# EAGLE design elektrosluch (EAGLE 7.3.0)
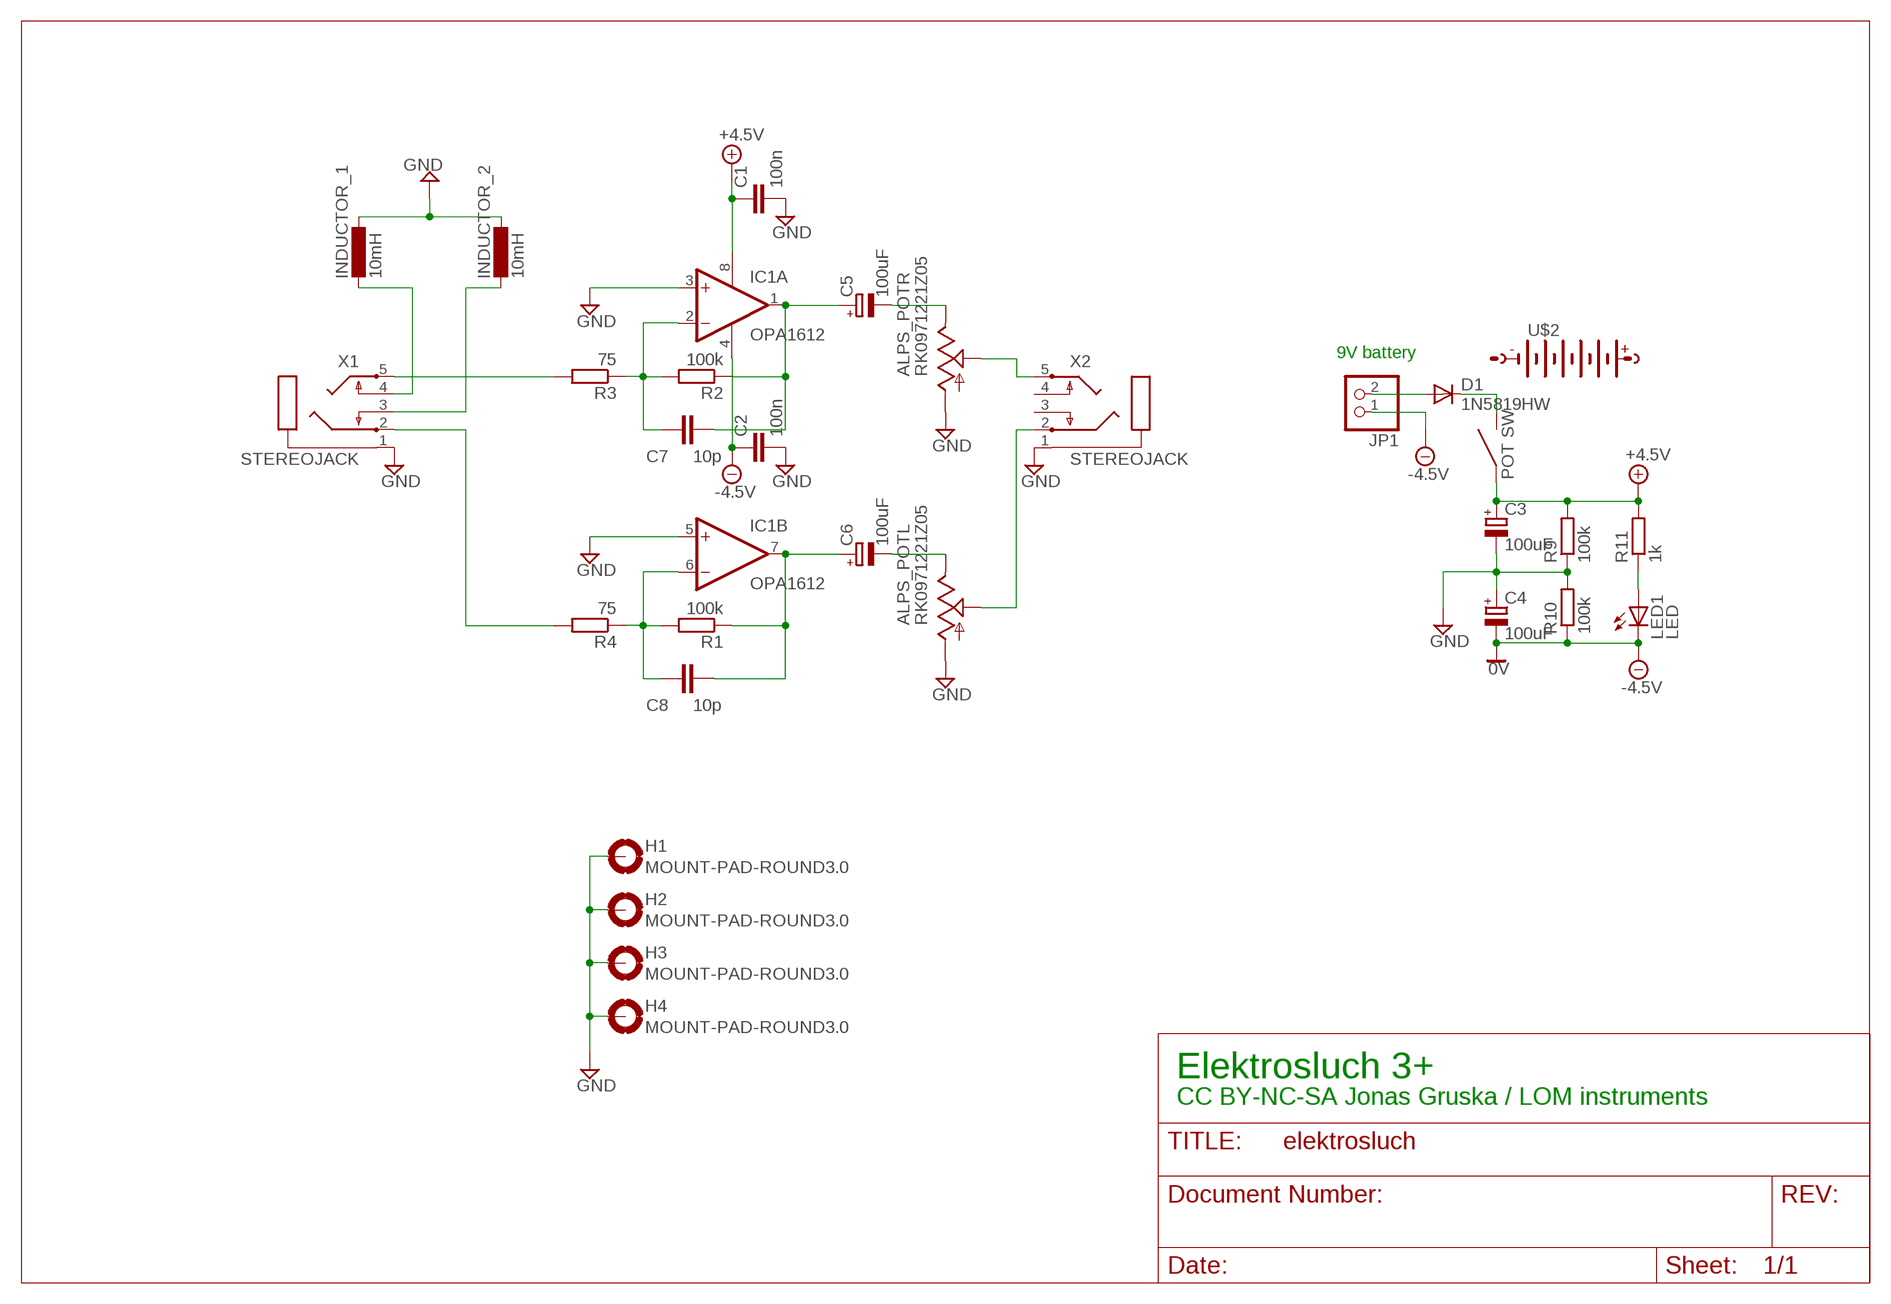
[diagram p0: schematic, sheet 1]

## Parts
ALPS_POT  RK0971221Z05  ALPS_RK0971221Z0N  [ALPS_RK0971221Z0X]
C1  100n  C-EUC0603  [C0603]
C2  100n  C-EUC0603  [C0603]
C3  100uF  CPOL-EUUD-6,3X8,8  [UD-6,3X5,8_NICHICON]
C4  100uF  CPOL-EUUD-6,3X8,8  [UD-6,3X5,8_NICHICON]
C5  100uF  CPOL-EUUD-6,3X8,8  [UD-6,3X5,8_NICHICON]
C6  100uF  CPOL-EUUD-6,3X8,8  [UD-6,3X5,8_NICHICON]
C7  10p  C-EUC0603  [C0603]
C8  10p  C-EUC0603  [C0603]
D1  1N5819HW  DIODE-SOD123  [SOD123]
H1  MOUNT-PAD-ROUND3.0  [3,0-PAD]
H2  MOUNT-PAD-ROUND3.0  [3,0-PAD]
H3  MOUNT-PAD-ROUND3.0  [3,0-PAD]
H4  MOUNT-PAD-ROUND3.0  [3,0-PAD]
IC1  OPA1612  OPA2134UA  [SO08]
INDUCTOR_1  10mH  COIL  [COIL]
INDUCTOR_2  10mH  COIL  [COIL]
JP1  PINHD-1X2  [1X02]
LED1  LED  [LED3MM]
R1  100k  R-EU_R0805  [R0805]
R2  100k  R-EU_R0805  [R0805]
R3  75  R-EU_R0805  [R0805]
R4  75  R-EU_R0805  [R0805]
R9  100k  R-EU_R0805  [R0805]
R10  100k  R-EU_R0805  [R0805]
R11  1k  R-EU_R0805  [R0805]
U$2  BATT  [BATT]
X1  STEREOJACK  [STX3100]
X2  STEREOJACK  [STX3100]

## Nets
+5V: ALPS_POT.S1 C1.1 C3.+ IC1.8(A:V+) R9.2 R11.2 ; supply symbol labelled +4.5V
-5V: C2.1 C4.- IC1.4(A:V-) JP1.1 LED1.K(C) R10.1 ; supply symbol labelled -4.5V, 0V
GND: ALPS_POT.G1 ALPS_POT.G2 C1.2 C2.2 C3.- C4.+ H1.B3,0(MOUNT) H2.B3,0(MOUNT) H3.B3,0(MOUNT) H4.B3,0(MOUNT) IC1.3(A:+IN) IC1.5(B:+IN) INDUCTOR_1.P$1 INDUCTOR_2.P$1 R9.1 R10.2 X1.1 X2.1
N$1: C7.1 IC1.2(A:-IN) R2.2 R3.1
N$2: C5.+ C7.2 IC1.1(A:OUT) R2.1
N$3: ALPS_POT.I1 C6.-
N$4: C8.1 IC1.6(B:-IN) R1.2 R4.1
N$5: C6.+ C8.2 IC1.7(B:OUT) R1.1
N$6: ALPS_POT.I2 C5.-
N$7: ALPS_POT.O2 X2.5
N$8: R3.2 X1.5
N$9: ALPS_POT.O1 X2.2
N$10: R4.2 X1.2
N$11: D1.A JP1.2
N$12: INDUCTOR_1.P$2 X1.4
N$13: INDUCTOR_2.P$2 X1.3
N$14: LED1.A R11.1
N$16: ALPS_POT.S2 D1.C
Unconnected: X2.3 X2.4

## Notes on the sheet
- 9V battery
- Elektrosluch 3+
- CC BY-NC-SA Jonas Gruska / LOM instruments

## Library data of the parts
ALPS_POT = audio-pots:ALPS_RK0971221Z0*: ALPS RK0971221Z Dual-gang 9mm potentiometer for volume control, with SPST switch -05 model: 10K with "volume" taper -0N model: 50K with traditional audio taper
C1 C2 C7 C8 = rcl:C-EU: CAPACITOR, European symbol
C3-C6 = rcl:CPOL-EU: POLARIZED CAPACITOR, European symbol
D1 = diode:DIODE-: DIODE
H1-H4 = holes:MOUNT-PAD-ROUND: MOUNTING PAD, round
IC1 = linear:OPA2*: Dual Operational Amplifier Low Power, Single-Supply, Rail-To-Rail Operational Amplifier Source: http://focus.ti.com/lit/ds/symlink/opa2345.pdf http://focus.ti.com .. opa241.pdf http://focus.ti.com/lit/ds/symlink/opa2134.pdf
INDUCTOR_1 INDUCTOR_2 = mojakniznica:COIL
JP1 = pinhead:PINHD-1X2: PIN HEADER
LED1 = mojakniznica:LED
R1-R4 R9-R11 = rcl:R-EU_: RESISTOR, European symbol
U$2 = mojakniznica:BATT
X1 X2 = adafruit:STEREOJACK: MIC/HEADPHONE JACK Stereo jack with two switches. Kycon STX3100, CUI SJ1-3555NG and/or 4UCon 05544

## Board
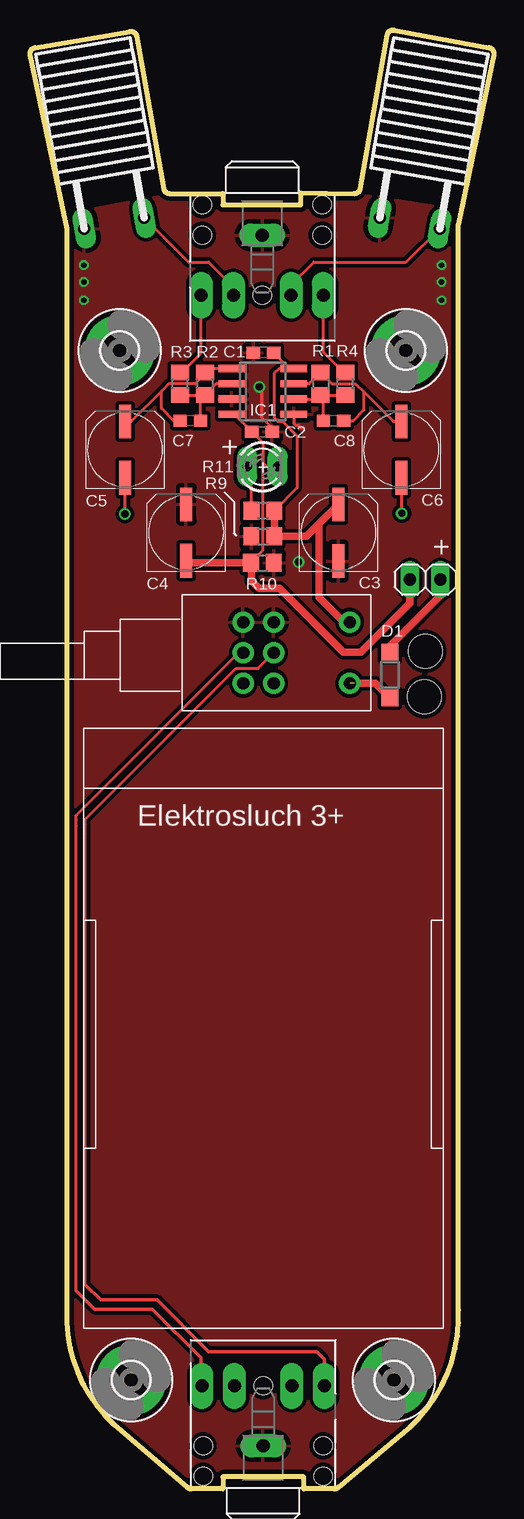
[diagram p1: board, top side]
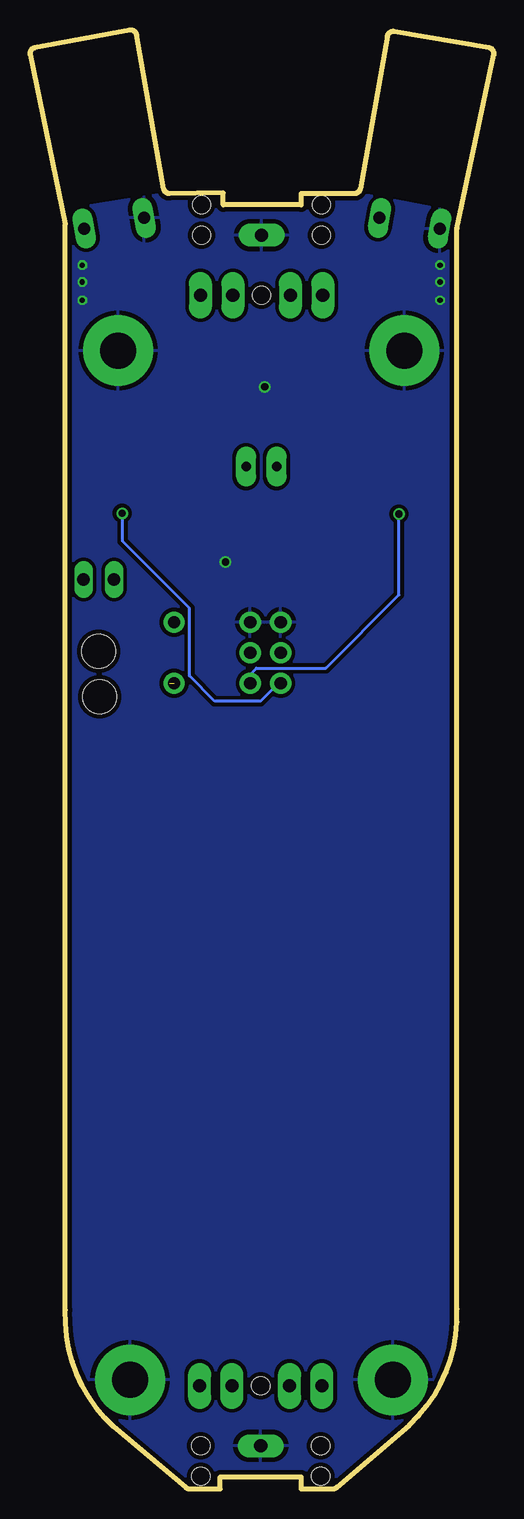
[diagram p2: board, bottom side, seen from below]

Size 38.7 x 121.58 mm. Coordinates in mm from the lower left corner, seen from the top.
Outline: 25.72,0.15 31.72,5.19 arc50 35.74,14.91 35.74,105.41 38.69,119.52 arc90 38.29,120.11 30.39,121.57 arc90 29.8,121.17 27.56,108.36 arc-80 27.06,107.95 22.59,108 22.59,107 16.09,107 16.09,107.95 11.65,107.95 arc-79 11.15,108.36 8.9,121.05 arc89 8.32,121.45 0.42,120.1 arc90 0.01,119.52 3.09,105.03 3.09,14.98 arc50 7.05,5.32 13.11,0.15 arc45 13.47,0 16.09,0 16.09,1 22.84,1 22.84,0 25.36,0 arc45 25.72,0.15
Copper layers (1*16): Top 0.0356mm / dielectric 1.5011mm / Bottom 0.0356mm
Design rules "LaenPCBOrder *": minimum track width 6mil, minimum drill 13mil, track to track 6mil, track to pad 6mil, pad to pad 6mil, via to via 6mil, smd to smd 6mil, copper to edge 15mil, drill to drill 6mil, minimum pad ring 7mil, minimum via ring 7mil, stop-mask expansion 3mil, vias tented up to drill 0mil, thermal gap 15mil
Holes 2.8 mm at 32.97,69.81 32.89,66.02

### Footprints (pad centres in the part's own frame; a part is rotated, then mirrored left to right if it is on the bottom)
ALPS_RK0971221Z0X = drill 1.016 pad 1.778: G1 10.74,2.26; G2 8.2,2.26; I1 10.74,7.34; I2 8.2,7.34; O1 10.74,4.8; O2 8.2,4.8; S1 1.85,2.26; S2 1.85,7.34
C0603 = smd 1.1 x 1: 1 -0.85,0; 2 0.85,0
UD-6,3X5,8_NICHICON = smd 2.8 x 1: + 2.35,0; - -2.35,0
SOD123 = smd 1.4 x 1.4: A 1.9,0; C -1.9,0
3,0-PAD = drill 3 pad 5.842: B3,0 0,0
SO08 = smd 0.6 x 2.2: 1 -1.905,-2.6; 2 -0.635,-2.6; 3 0.635,-2.6; 4 1.905,-2.6; 5 1.905,2.6; 6 0.635,2.6; 7 -0.635,2.6; 8 -1.905,2.6
COIL = drill 1 pad 1.676 long: P$1 -2.54,0; P$2 2.54,0
1X02 = drill 1.016 long: 1 -1.27,0; 2 1.27,0
LED3MM = drill 0.8 pad 1.676 long: A -1.27,0; K 1.27,0
R0805 = smd 1.3 x 1.5: 1 -0.95,0; 2 0.95,0
STX3100 = drill 1.1 pad 1.93 long: 1 2.7,-0.1; 2 7.7,5; 3 7.7,2.3; 4 7.7,-2.5; 5 7.7,-5.2 | hole 1.5: 2.7,4.9; 2.7,-5.1; 7.7,-0.1; 2.7,4.9; 0.16,4.9; 2.7,-5.1; 0.16,-5.1

### Placement (x,y rotation side)
ALPS_POT  28.53,74.49 180 top
C1  19.48,94.7 180 top
C2  19.35,88.1 0 top
C3  25.73,79.68 90 top
C4  13.03,79.71 90 top
C5  7.92,86.61 90 top
C6  30.97,86.61 90 top
C7  13.38,89.03 180 top
C8  25.32,89.03 0 top
D1  30.02,67.82 90 top
H1  30.36,9.08 0 top
H2  8.43,9.08 0 top
H3  31.35,94.87 0 top
H4  7.48,94.87 0 top
IC1  19.42,91.47 270 top
INDUCTOR_1  7.03,105.47 10 top
INDUCTOR_2  31.67,105.47 350 top
JP1  32.97,75.78 0 top
LED1  19.39,85.19 0 top
R1  24.24,92.1 270 top
R2  14.59,92.1 270 top
R3  12.52,92.1 90 top
R4  26.3,92.1 90 top
R9  19.42,79.38 0 top
R10  19.39,77.17 0 top
R11  19.43,81.53 0 top
U$2  34.46,13.4 90 top
U$4  [LOM_BACK]  10.46,59.88 0 top
X1  19.48,107.18 270 top
X2  19.35,0.89 90 top

### Tracks (layer width: path | path; a pad name or v marks a point on that pad's centre or on a via)
+5V
  Top 0.254: C1.1 21.66,93.37 | 21.66,93.37 IC1.8 | 21.66,93.37 20.77,93.37 20.37,92.96 20.37,89.28 20.69,88.96 21.07,88.96 21.89,88.14 | 25.7,82.06 C3.+ | 21.76,88.27 21.89,88.14 | 21.89,88.14 22.02,88.01 22.27,87.76 22.27,83.43 R11.2
  Top 0.61: C3.+ 24.2,80.5 | 24.2,80.5 23.07,79.38 R9.2 R11.2 | ALPS_POT.S1 26.18,72.22 24.11,74.3 24.11,80.42 24.2,80.5
-5V
  Top 0.254: C2.1 17.04,89.56 IC1.4 | C2.1 18.5,87.72 18.88,87.72 | R10.1 18.44,77.22 19.43,78.21 19.43,82.82 19.43,83.64 19.43,86.31 | C2.1 19.43,87.17 19.43,86.31 | 19.43,86.31 19.43,85.52 19.73,85.22 20.63,85.22 LED1.K
  Top 0.61: C4.- 13.22,77.17 R10.1 18.46,77.14 18.46,75.69 19.1,75.06 20.81,75.06 22.78,73.09 26.15,69.72 27.61,69.72 31.7,73.81 JP1.1
GND  (via drill 0.43, 0.6)
  Top 0.254: 22.01,89.54 IC1.5 22.01,88.78 22.15,88.65 22.4,88.65 22.65,88.39 | C2.2 20.2,88.43 19.35,89.28 19.35,91.62 v19.12,91.85
  other vias: 22.4,77.24 4.49,101.98 4.49,100.58 4.49,99.06 34.34,101.98 34.34,100.58 34.34,99.06
  pour Bottom (isolate 0.305): 2.09,106.17 11.22,107.95 27.48,107.95 36.75,106.43 36.88,0 2.09,-0.5
  pour Top (isolate 0.305): 2.46,106.17 11.22,107.82 27.23,107.95 36.88,106.43 36.88,-0.5 2.59,-0.5
N$1
  Top 0.254: IC1.2 15.54,92.1 R2.2 | 12.53,91.15 R3.1 12.53,91.15 | 12.53,91.15 R2.2 | 12.53,91.15 12.53,90.73 | C7.1 14.23,90.79 R2.2
N$2
  Top 0.254: IC1.1 14.59,93.37 R2.1 14.59,92.9 13.78,92.09 11.58,92.09 11.01,91.52 | 11.01,91.52 8.46,88.96 C5.+ | C7.2 11.99,89.03 10.97,90.04 10.97,91.48 11.01,91.52
N$3  (via drill 0.6)
  Top 0.254: v31.01,81.31 31.01,84.23 C6.-
  Bottom 0.254: v31.01,81.31 30.98,81.28 30.98,78.99 25.4,73.41 25.4,67.77 23.29,65.66 19.48,65.66 17.99,67.14 ALPS_POT.I1
N$4
  Top 0.254: IC1.6 23.92,90.83 R1.2 | R1.2 R4.1 | C8.1 24.47,90.92 R1.2
N$5
  Top 0.254: IC1.7 23.29,92.1 R1.1 25.19,92.1 27.16,92.1 27.84,91.42 | 27.84,91.42 30.3,88.96 C6.+ | C8.2 26.97,89.03 27.86,89.92 27.86,91.4 27.84,91.42
N$6  (via drill 0.6)
  Top 0.254: 8.15,84.49 C5.- 7.92,81.41 v7.92,81.25
  Bottom 0.254: ALPS_POT.I2 21.07,67.14 19.81,68.4 14.02,68.4 7.92,74.5 v7.92,81.25
N$7
  Top 0.254: 4.62,17.02 4.62,54.64 4.62,55.37 4.62,55.82 17.19,68.39 19.03,68.39 ALPS_POT.O2
  Top 0.305: X2.5 24.55,10.8 23.92,11.43 14.91,11.43 10.59,15.75 5.89,15.75 4.62,17.02
N$8
  Top 0.254: X1.5 14.28,94.64 12.68,93.05 R3.2
N$9
  Top 0.254: 10.21,14.99 5.38,14.99 3.86,16.51 3.86,55.25 3.86,55.76 3.86,56.13 16.75,69.03 17.07,69.34 17.44,69.34 ALPS_POT.O1
  Top 0.305: 3.86,16.51 5.38,14.99 10.21,14.99 14.27,10.92 14.27,8.89 14.78,8.38 14.56,8.38 X2.2
N$10
  Top 0.254: X1.2 24.48,94.72 26.15,93.05 R4.2
N$11
  Top 0.61: D1.A 30.02,70.23 34.34,74.55 34.34,75.68 JP1.2
N$12
  Top 0.254: INDUCTOR_1.P$2 13.21,102.23 14.91,102.23 16.98,100.16 X1.4
N$13
  Top 0.254: X1.3 21.78,100.34 23.67,102.23 25.49,102.23 31.37,102.23 INDUCTOR_2.P$2
N$14
  Top 0.254: R11.1 18.48,83.53 18.12,83.89 LED1.A
N$16  (1 unrouted)
  Top 0.61: 27.06,67.14 28.79,67.14 D1.C

### Text on the board
tNames: + | + | Elektrosluch 3+
tStop: electromagnetic listening / gateway drug | Designed by / Jonas Gruska / & Birch Cooper / (cc) 2016